# EAGLE design RFDuino_badge (EAGLE 7.2.0)
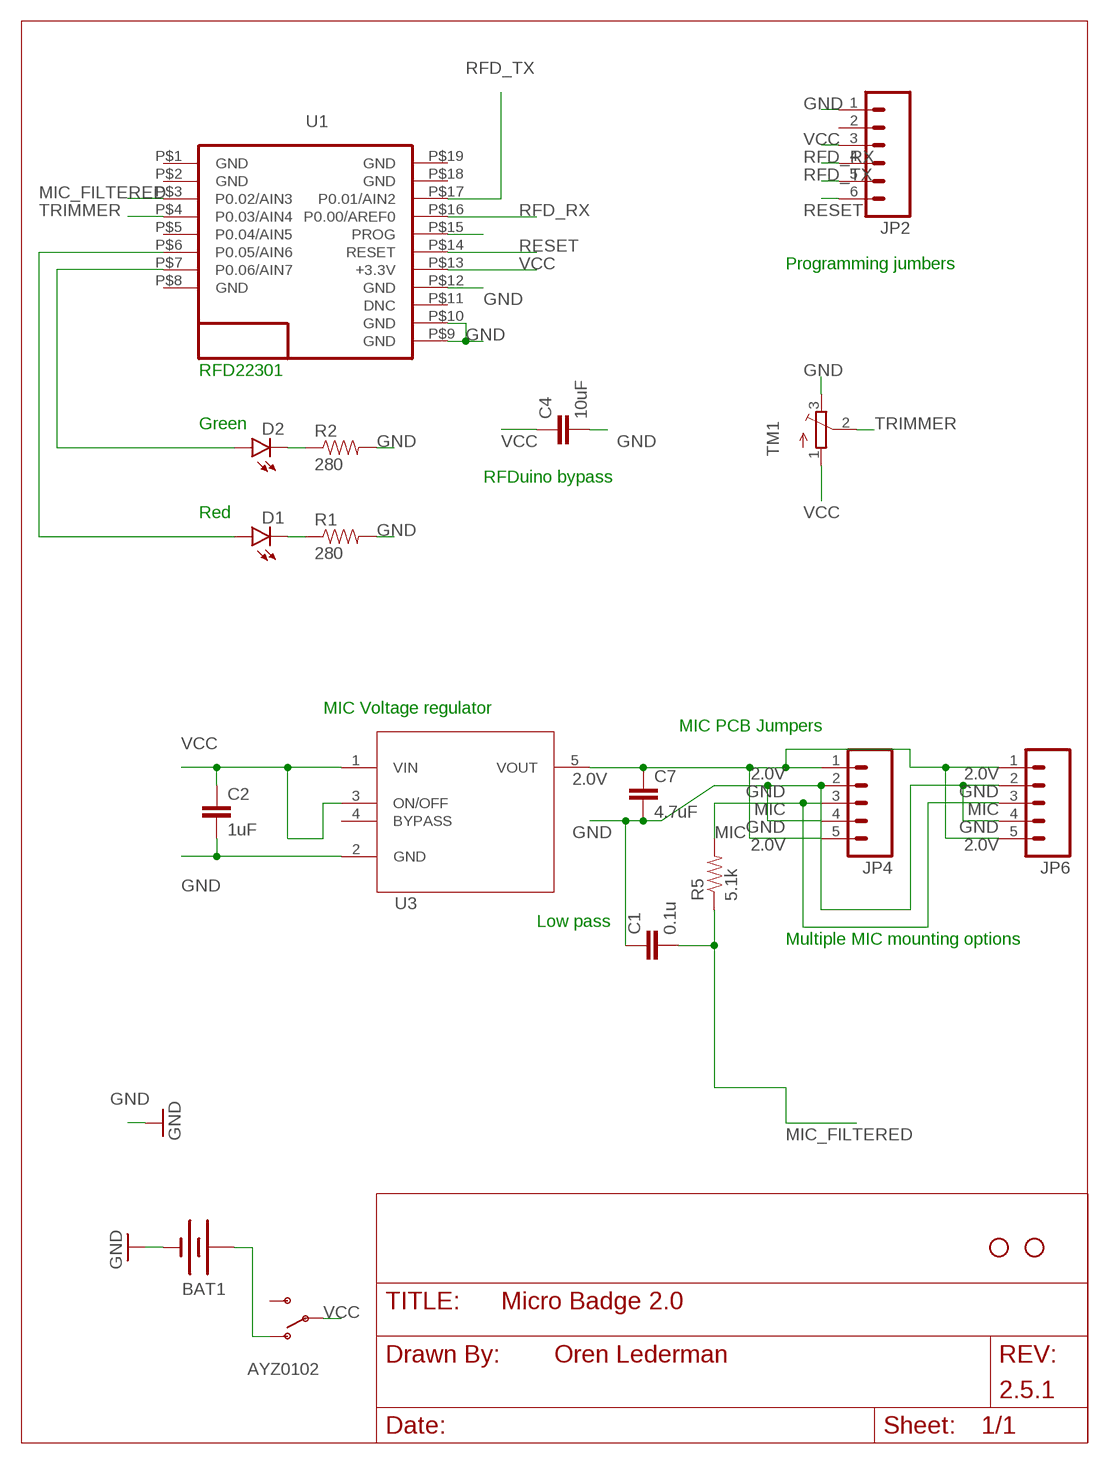
[diagram p0: schematic, sheet 1]

## Parts
AYZ0102  AYZ0102AGRLCAYZ0102AGRLC  [KPS-1290]
BAT1  BATTERY20MM_4LEGS_OVERPASTE  [BATTCON_20MM_4LEGS_OVERPASTE]
C1  0.1u  CAP1206  [1206]
C2  1uF  CAP1206  [1206]
C4  10uF  CAP1206  [1206]
C7  4.7uF  CAP1206  [1206]
D1  LED1206  [LED-1206]
D2  LED1206  [LED-1206]
JP2  M06LONGPADS  [1X06_LONGPADS]
JP4  M05PTH_LONGPADS  [1X05_LONGPADS]
JP6  M05PTH  [1X05]
R1  280  RESISTOR1206  [1206]
R2  280  RESISTOR1206  [1206]
R5  5.1k  RESISTOR1206  [1206]
STANDOFF1  STAND-OFF  [STAND-OFF]
STANDOFF2  STAND-OFF  [STAND-OFF]
TM1  TRIMPOTTC33X  [TC33X]
U1  RFD22301  [RFD21733]
U3  LP2985AIM5-2.5  [SOT95P285X120-5N]

## Nets
2.0V: C7.1 JP4.1 JP4.5 JP6.1 JP6.5 U3.5(VOUT)
AIN6: D1.A U1.P$6(P0.05/AIN6)
AIN7: D2.A U1.P$7(P0.06/AIN7)
GND: BAT1.2(-) C1.1 C2.2 C4.2 C7.2 JP2.1 JP4.2 JP4.4 JP6.2 JP6.4 R1.2 R2.2 TM1.3(E) U1.P$9(GND) U1.P$10(GND) U1.P$12(GND) U3.2(GND)
MIC: JP4.3 JP6.3 R5.2
MIC_FILTERED: C1.2 R5.1 U1.P$3(P0.02/AIN3)
N$1: AYZ0102.O BAT1.1(+)
N$3: D2.C R2.1
N$4: D1.C R1.1
N$7: U1.P$15(PROG)
RESET: JP2.6 U1.P$14(RESET)
RFD_RX: JP2.4 U1.P$16(P0.00/AREF0)
RFD_TX: JP2.5 U1.P$17(P0.01/AIN2)
TRIMMER: TM1.2(S) U1.P$4(P0.03/AIN4)
VCC: AYZ0102.P C2.1 C4.1 JP2.3 TM1.1(A) U1.P$13(+3.3V) U3.1(VIN) U3.3(ON/OFF)
Unconnected: AYZ0102.S JP2.2 U1.P$1(GND) U1.P$2(GND) U1.P$5(P0.04/AIN5) U1.P$8(GND) U1.P$11(DNC) U1.P$18(GND) U1.P$19(GND) U3.4(BYPASS)

## Notes on the sheet
- U1
- Programming jumbers
- RFD22301
- Green
- RFDuino bypass
- Red
- MIC Voltage regulator
- MIC PCB Jumpers
- U3
- Low pass
- Multiple MIC mounting options

## Library data of the parts
AYZ0102 = oren:AYZ0102AGRLC; PROD_ID: AYZ0102AGRLC
BAT1 = SparkFun-Electromechanical:BATTERY: Battery Holders Various common sizes : AA, AAA, 18650 (PRT-12895), 20mm coin cell and 12mm coin cell. 20MM_4LEGS, BATT-10373
C1 C2 C4 C7 = SparkFun-Passives:CAP: Capacitor Standard 0603 ceramic capacitor, and 0.1" leaded capacitor.
D1 D2 = SparkFun-LED:LED: LEDs Standard schematic elements and footprints for 5mm, 3mm, 1206, and 0603 sized LEDs. 5mm - Spark Fun Electronics SKU : COM-00529 (and others)
JP2 = SparkFun-Connectors:M06: Header 6 Standard 6-pin 0.1" header. Use with straight break away headers (SKU : PRT-00116), right angle break away headers (PRT-00553), swiss pins (PRT-00743), machine pins (PRT-00117), and female headers (PRT-00115). Molex polarized connector foot print use with SKU : PRT-08094 with associated crimp pins and housings. NOTES ON THE VARIANTS LOCK and LOCK_LONGPADS... This footprint was designed to help hold the alignment of a through-hole component (i.e. 6-pin header) while soldering it into place. You may notice that each hole has been shifted either up or down by 0.005 of an inch from it's more standard position (which is a perfectly straight line). This slight alteration caused the pins (the squares in the middle) to touch the edges of the holes. Because they are alternating, it causes a "brace" to hold the component in place. 0.005 has proven to be the perfect amount of "off-center" position when using our standard breakaway headers. Although looks a little odd when you look at the bare footprint, once you have a header in there, the alteration is very hard to notice. Also,if you push a header all the way into place, it is covered up entirely on the bottom side. This idea of altering the position of holes to aid alignment will be further integrated into the Sparkfun Library for other footprints. It can help hold any component with 3 or more connection pins.
JP4 JP6 = SparkFun-Connectors:M05: Header 5 Standard 5-pin 0.1" header. Use with straight break away headers (SKU : PRT-00116), right angle break away headers (PRT-00553), swiss pins (PRT-00743), machine pins (PRT-00117), and female headers (PRT-00115). Molex polarized connector foot print use with SKU : PRT-08230 with associated crimp pins and housings.
R1 R2 R5 = SparkFun-Passives:RESISTOR: Resistor Basic schematic elements and footprints for 0603, 1206, and PTH resistors.
STANDOFF1 STANDOFF2 = SparkFun-Electromechanical:STAND-OFF: #4 Stand Off This is the mechanical footprint for a #4 phillips button head screw. Use the keepout ring to avoid running the screw head into surrounding components. SKU : PRT-00447
TM1 = adafruit:TRIMPOT: SMT trimmer potentiometer part number TC33X http://www.ladyada.net/library/eagle
U1 = RFD22301-11.25.13:RFD22301: RF Digital RFD22301
U3 = LP2985AIM5-2.5:LP2985AIM5-2.5; MPN: LP2985AIM5-2.5; OC_FARNELL: 9778543; OC_NEWARK: 41K6881; PACKAGE: SOT23-5; SUPPLIER: National Semiconductors

## Board
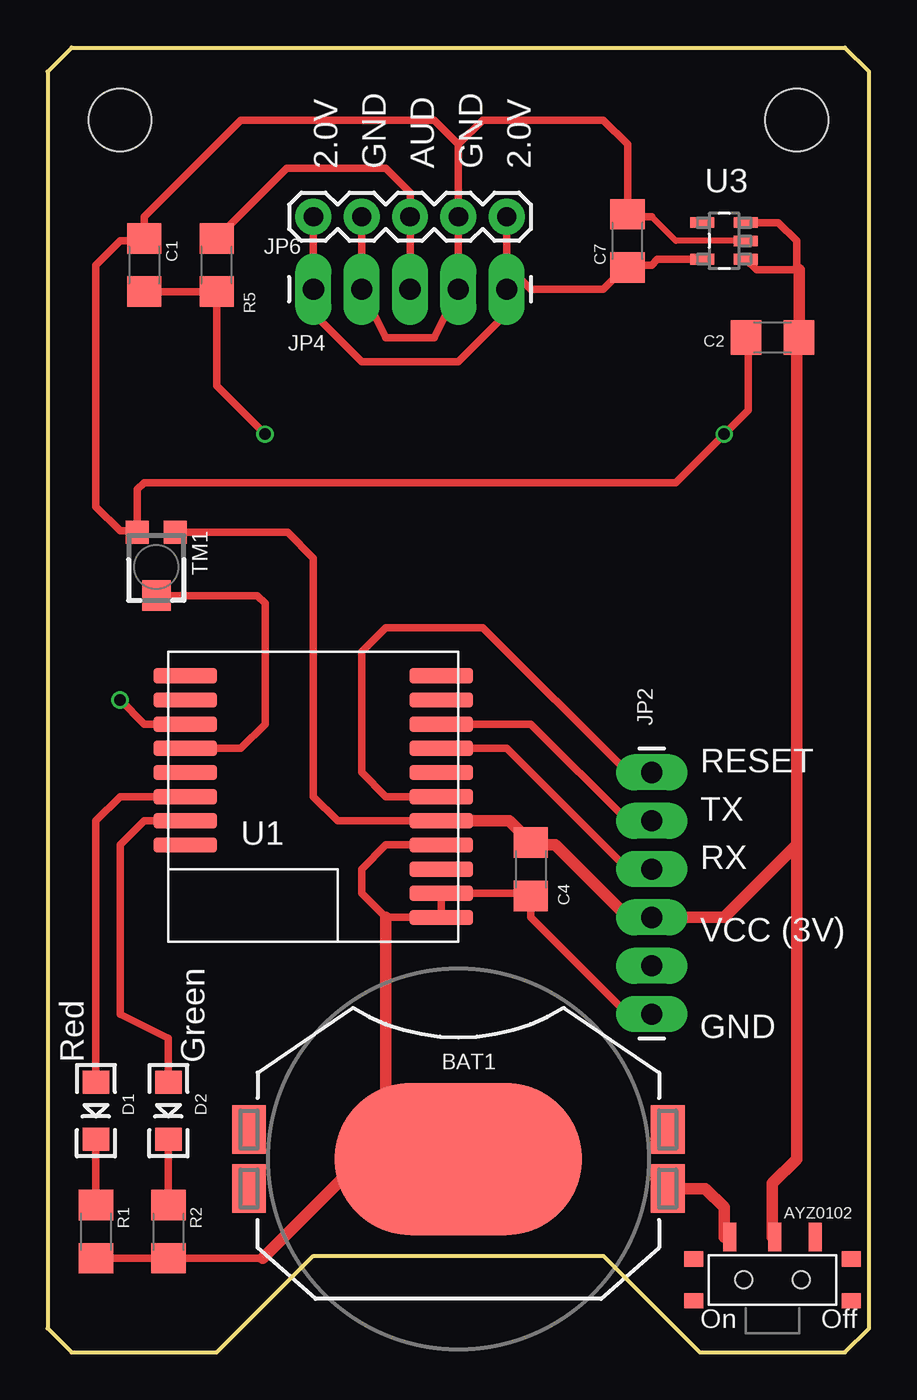
[diagram p1: board, top side]
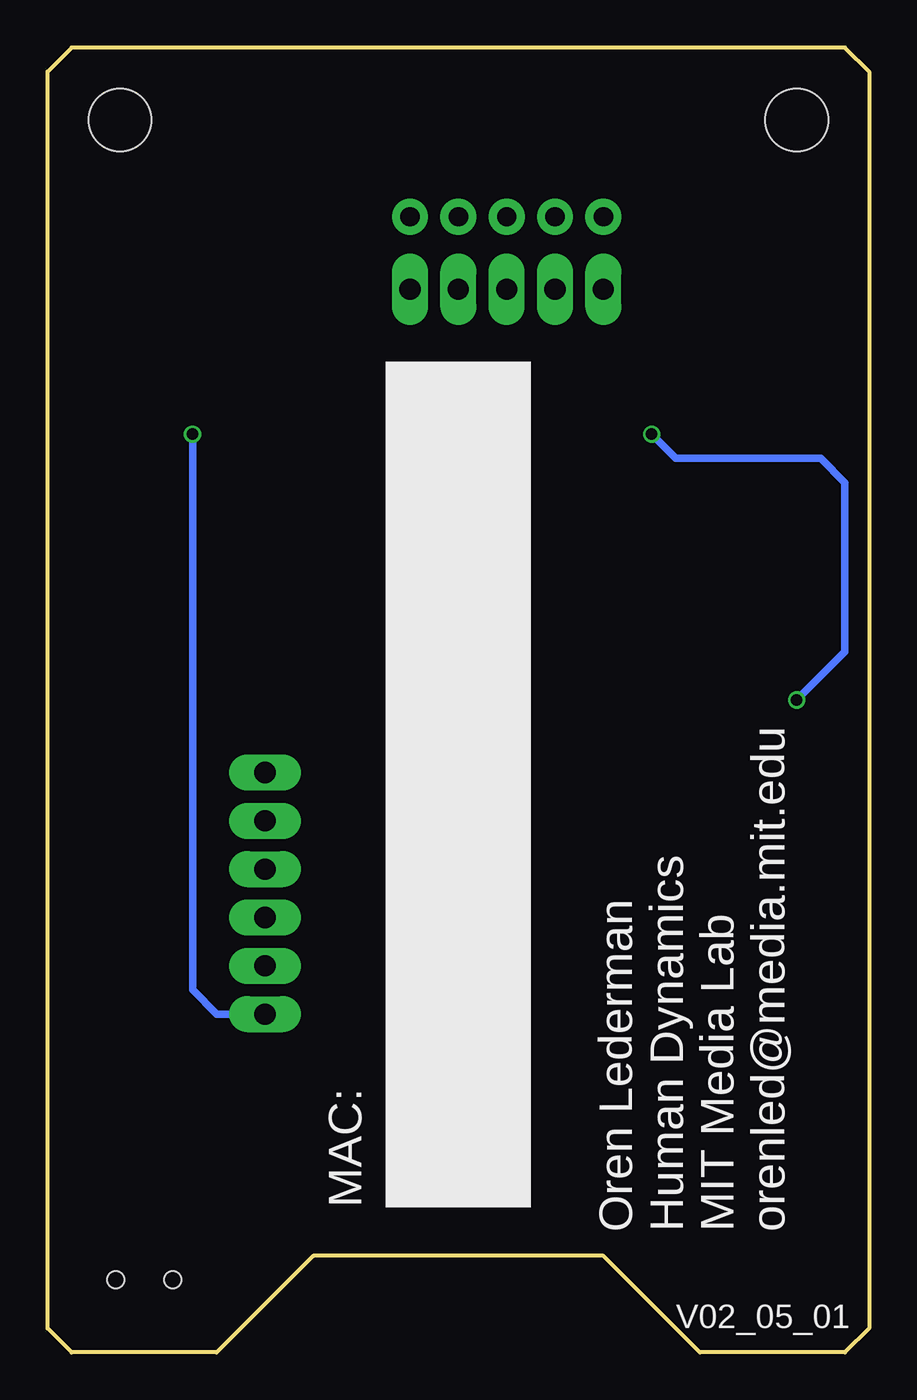
[diagram p2: board, bottom side, seen from below]

Size 43.18 x 68.58 mm. Coordinates in mm from the lower left corner, seen from the top.
Outline: 1.27,68.58 41.91,68.58 43.18,67.31 43.18,1.27 41.91,0 34.29,0 29.21,5.08 13.97,5.08 8.89,0 1.27,0 0,1.27 0,67.31 1.27,68.58
Copper layers (1*16): Top 0.035mm / dielectric 1.5mm / Bottom 0.035mm
Design rules "ITEADstudio_DRC": minimum track width 6mil, minimum drill 12mil, track to track 6mil, track to pad 6mil, pad to pad 6mil, via to via 6mil, smd to smd 0mil, copper to edge 10mil, drill to drill 10mil, minimum pad ring 10mil, minimum via ring 6mil, stop-mask expansion 2mil, vias tented up to drill 100mil, thermal gap 10mil

### Footprints (pad centres in the part's own frame; a part is rotated, then mirrored left to right if it is on the bottom)
KPS-1290 = smd 0.7 x 1.5: O -2.25,2.25; P 0.115,2.25; S 2.25,2.25 | smd 1 x 0.8: P$1 -4.15,1.1; P$2 -4.15,-1.1; P$3 4.15,-1.1; P$4 4.15,1.1 | hole 0.9: -1.5,0; 1.5,0
BATTCON_20MM_4LEGS_OVERPASTE = smd 1.778 x 2.54: 1 -11,1.55; 3 11,1.55; P$1 -11,-1.55; P$2 11,-1.55 | smd 13 x 8: 2 0,0
1206 = smd 1.6 x 1.8: 1 -1.4,0; 2 1.4,0
LED-1206 = smd 1.2 x 1.4: A -1.5,0; C 1.5,0
1X06_LONGPADS = drill 1.118 pad 1.88 long: 1 0,0; 2 2.54,0; 3 5.08,0; 4 7.62,0; 5 10.16,0; 6 12.7,0
1X05_LONGPADS = drill 1.118 pad 1.88 long: 1 0,0; 2 2.54,0; 3 5.08,0; 4 7.62,0; 5 10.16,0
1X05 = drill 1.016 pad 1.88: 1 0,0; 2 2.54,0; 3 5.08,0; 4 7.62,0; 5 10.16,0
STAND-OFF = hole 3.302: 0,0
TC33X = smd 1.2 x 1.2: 1 -1,-1.825; 3 1,-1.825 | smd 1.5 x 1.6: 2 0,1.5
RFD21733 = smd 3.353 x 0.813: P$1 -6.731,6.35; P$2 -6.731,5.08; P$3 -6.731,3.81; P$4 -6.731,2.54; P$5 -6.731,1.27; P$6 -6.731,0; P$7 -6.731,-1.27; P$8 -6.731,-2.54; P$9 6.731,-6.35; P$10 6.731,-5.08; P$11 6.731,-3.81; P$12 6.731,-2.54; P$13 6.731,-1.27; P$14 6.731,0; P$15 6.731,1.27; P$16 6.731,2.54; P$17 6.731,3.81; P$18 6.731,5.08; P$19 6.731,6.35
SOT95P285X120-5N = smd 1.27 x 0.559: 1 -1.143,0.965; 2 -1.143,0; 3 -1.143,-0.965; 4 1.143,-0.965; 5 1.143,0.965

### Placement (x,y rotation side)
AYZ0102  38.1,3.81 0 top
BAT1  21.59,10.16 180 top
C1  5.08,57.15 270 top
C2  38.1,53.34 180 top
C4  25.4,25.4 270 top
C7  30.48,58.42 90 top
D1  2.54,12.7 270 top
D2  6.35,12.7 270 top
JP2  31.75,17.78 90 top
JP4  13.97,55.88 0 top
JP6  13.97,59.69 0 top
R1  2.54,6.35 270 top
R2  6.35,6.35 270 top
R5  8.89,57.15 90 top
STANDOFF1  3.81,64.77 0 top
STANDOFF2  39.37,64.77 0 top
TM1  5.71,41.27 180 top
U1  13.97,29.21 0 top
U3  35.56,58.42 180 top

### Tracks (layer width: path | path; a pad name or v marks a point on that pad's centre or on a via)
2.0V
  Top 0.406: JP6.1 JP4.1 13.97,54.61 16.51,52.07 21.59,52.07 24.13,54.61 JP4.5 24.13,57.15 | 24.13,57.15 JP6.5 | U3.5 32.05,57.45 31.75,57.15 30.61,57.15 C7.1 30.35,57.02 29.21,55.88 25.4,55.88 24.13,57.15
AIN6
  Top 0.406: D1.A 2.54,27.94 3.81,29.21 U1.P$6
AIN7
  Top 0.406: D2.A 6.35,16.51 3.81,17.78 3.81,26.67 5.08,27.94 U1.P$7
GND  (via drill 0.6)
  Top 0.305: U3.2 33.02,58.42 31.75,59.69 30.61,59.69 | 30.61,59.69 C7.2 | 30.61,59.69 30.48,59.69
  Top 0.406: R1.2 R2.2 11.3,4.95 | U1.P$12 17.78,26.67 16.51,25.4 16.51,24.13 17.78,22.86 U1.P$9 U1.P$10 25.27,24.13 C4.2 25.4,22.86 30.48,17.78 JP2.1 | 17.78,10.16 BAT1.2 | 30.35,59.69 C7.2 30.48,63.5 29.21,64.77 22.86,64.77 21.59,63.5 | 31.75,59.69 30.48,59.69 | 21.59,63.5 20.32,64.77 10.16,64.77 5.08,59.69 C1.1 4.95,58.42 3.81,58.42 2.54,57.15 2.54,44.45 3.81,43.18 4.63,43.18 TM1.3 4.71,45.35 5.08,45.72 33.02,45.72 v35.56,48.26 36.83,49.53 36.83,53.21 C2.2 | JP6.2 JP4.2 17.78,53.34 20.32,53.34 JP4.4 JP6.4 21.59,63.5
  Top 0.61: 17.78,22.86 17.78,10.16 16.51,10.16 11.3,4.95 | C2.2 36.7,53.21
  Bottom 0.406: v35.56,48.26 35.56,19.05 34.29,17.78 JP2.1
MIC
  Top 0.406: JP6.3 19.05,60.96 17.78,62.23 12.57,62.23 R5.2 | JP6.3 19.05,58.42 | JP6.3 JP4.3
MIC_FILTERED  (via drill 0.6)
  Top 0.406: v3.81,34.29 5.08,33.02 U1.P$3 | v11.43,48.26 8.89,50.8 R5.1 C1.2
  Bottom 0.406: v11.43,48.26 10.16,46.99 2.54,46.99 1.27,45.72 1.27,36.83 v3.81,34.29
N$1
  Top 0.61: AYZ0102.O 35.56,6.06 35.56,7.62 34.57,8.61 BAT1.1
N$3
  Top 0.406: D2.C R2.1
N$4
  Top 0.406: D1.C R1.1
RESET
  Top 0.406: U1.P$14 17.78,29.21 16.51,30.48 16.51,36.83 17.78,38.1 22.86,38.1 30.48,30.48 JP2.6
RFD_RX
  Top 0.406: U1.P$16 24.13,31.75 30.48,25.4 JP2.4
RFD_TX
  Top 0.406: U1.P$17 25.4,33.02 30.48,27.94 JP2.5
TRIMMER
  Top 0.406: TM1.2 11.03,39.77 11.43,39.37 11.43,33.02 10.16,31.75 U1.P$4
VCC
  Top 0.406: 25.53,26.8 C4.1 25.53,26.67 | 39.5,56.89 39.37,56.89 | 39.37,56.89 37.27,56.89 U3.1 | U3.3 38.41,59.38 39.37,58.42 39.37,56.89 | 21.59,27.94 15.24,27.94 13.97,29.21 13.97,41.75 12.62,43.1 TM1.1
  Top 0.61: U1.P$13 21.59,27.94 24.26,27.94 C4.1 | 25.53,26.67 26.67,26.67 30.48,22.86 JP2.3 35.56,22.86 39.37,26.67 | 39.37,26.67 39.37,53.21 C2.1 39.5,56.89 | AYZ0102.P 38.1,6.06 38.1,8.89 39.37,10.16 39.37,26.67

### Text on the board
tPlace: 2.0V | GND | AUD | GND | 2.0V | U3 | RESET | TX | RX | VCC (3V) | GND | Red | Green | On | Off
bPlace: MAC: | Oren Lederman / Human Dynamics / MIT Media Lab / orenled@media.mit.edu | V02_05_01